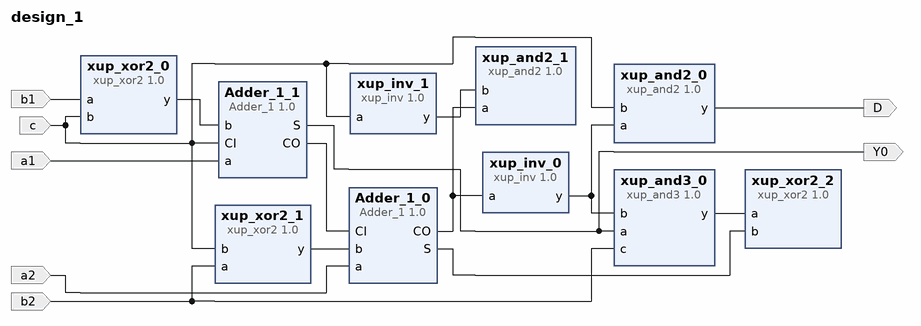
[diagram p0: block diagram of the top level]
# Vivado block design design_1, xc7a35tcpg236-1, Vivado 2021.1
create_bd_design design_1

create_bd_port -dir I b1
create_bd_port -dir I a1
create_bd_port -dir I c
create_bd_port -dir I b2
create_bd_port -dir I a2
create_bd_port -dir O Y0
create_bd_port -dir O D

create_bd_cell -type ip -vlnv xilinx.com:xup:xup_xor2:1.0 xup_xor2_0
create_bd_cell -type ip -vlnv xilinx.com:xup:xup_xor2:1.0 xup_xor2_1
create_bd_cell -type ip -vlnv xilinx.com:user:Adder_1:1.0 Adder_1_0
create_bd_cell -type ip -vlnv xilinx.com:user:Adder_1:1.0 Adder_1_1
create_bd_cell -type ip -vlnv xilinx.com:xup:xup_xor2:1.0 xup_xor2_2
create_bd_cell -type ip -vlnv xilinx.com:xup:xup_and3:1.0 xup_and3_0
create_bd_cell -type ip -vlnv xilinx.com:xup:xup_inv:1.0 xup_inv_0
create_bd_cell -type ip -vlnv xilinx.com:xup:xup_and2:1.0 xup_and2_0
create_bd_cell -type ip -vlnv xilinx.com:xup:xup_inv:1.0 xup_inv_1
create_bd_cell -type ip -vlnv xilinx.com:xup:xup_and2:1.0 xup_and2_1

# ---- connections ----

connect_bd_net [get_bd_pins Adder_1_0/CO] [get_bd_pins xup_inv_0/a] [get_bd_pins xup_and2_1/a]
connect_bd_net [get_bd_pins Adder_1_0/S] [get_bd_pins xup_xor2_2/b]
connect_bd_net [get_bd_pins Adder_1_1/CO] [get_bd_pins Adder_1_0/CI]
connect_bd_net [get_bd_pins Adder_1_1/S] [get_bd_ports Y0] [get_bd_pins xup_and3_0/a]
connect_bd_net -net a2_1 [get_bd_ports a2] [get_bd_pins Adder_1_0/a]
connect_bd_net [get_bd_ports a1] [get_bd_pins Adder_1_1/a]
connect_bd_net -net b2_1 [get_bd_ports b2] [get_bd_pins xup_xor2_1/a] [get_bd_pins xup_and3_0/c]
connect_bd_net [get_bd_ports b1] [get_bd_pins xup_xor2_0/a]
connect_bd_net [get_bd_ports c] \
  [get_bd_pins xup_xor2_1/b] [get_bd_pins Adder_1_1/CI] [get_bd_pins xup_xor2_0/b] [get_bd_pins xup_and2_0/b] \
  [get_bd_pins xup_inv_1/a]
connect_bd_net [get_bd_pins xup_and2_0/y] [get_bd_ports D]
connect_bd_net [get_bd_pins xup_and3_0/y] [get_bd_pins xup_xor2_2/a]
connect_bd_net [get_bd_pins xup_inv_0/y] [get_bd_pins xup_and3_0/b] [get_bd_pins xup_and2_0/a]
connect_bd_net [get_bd_pins xup_inv_1/y] [get_bd_pins xup_and2_1/b]
connect_bd_net [get_bd_pins xup_xor2_0/y] [get_bd_pins Adder_1_1/b]
connect_bd_net [get_bd_pins xup_xor2_1/y] [get_bd_pins Adder_1_0/b]

validate_bd_design
save_bd_design
